# Altium schematic sheet atmusic.SchDoc: atmusic
size A4
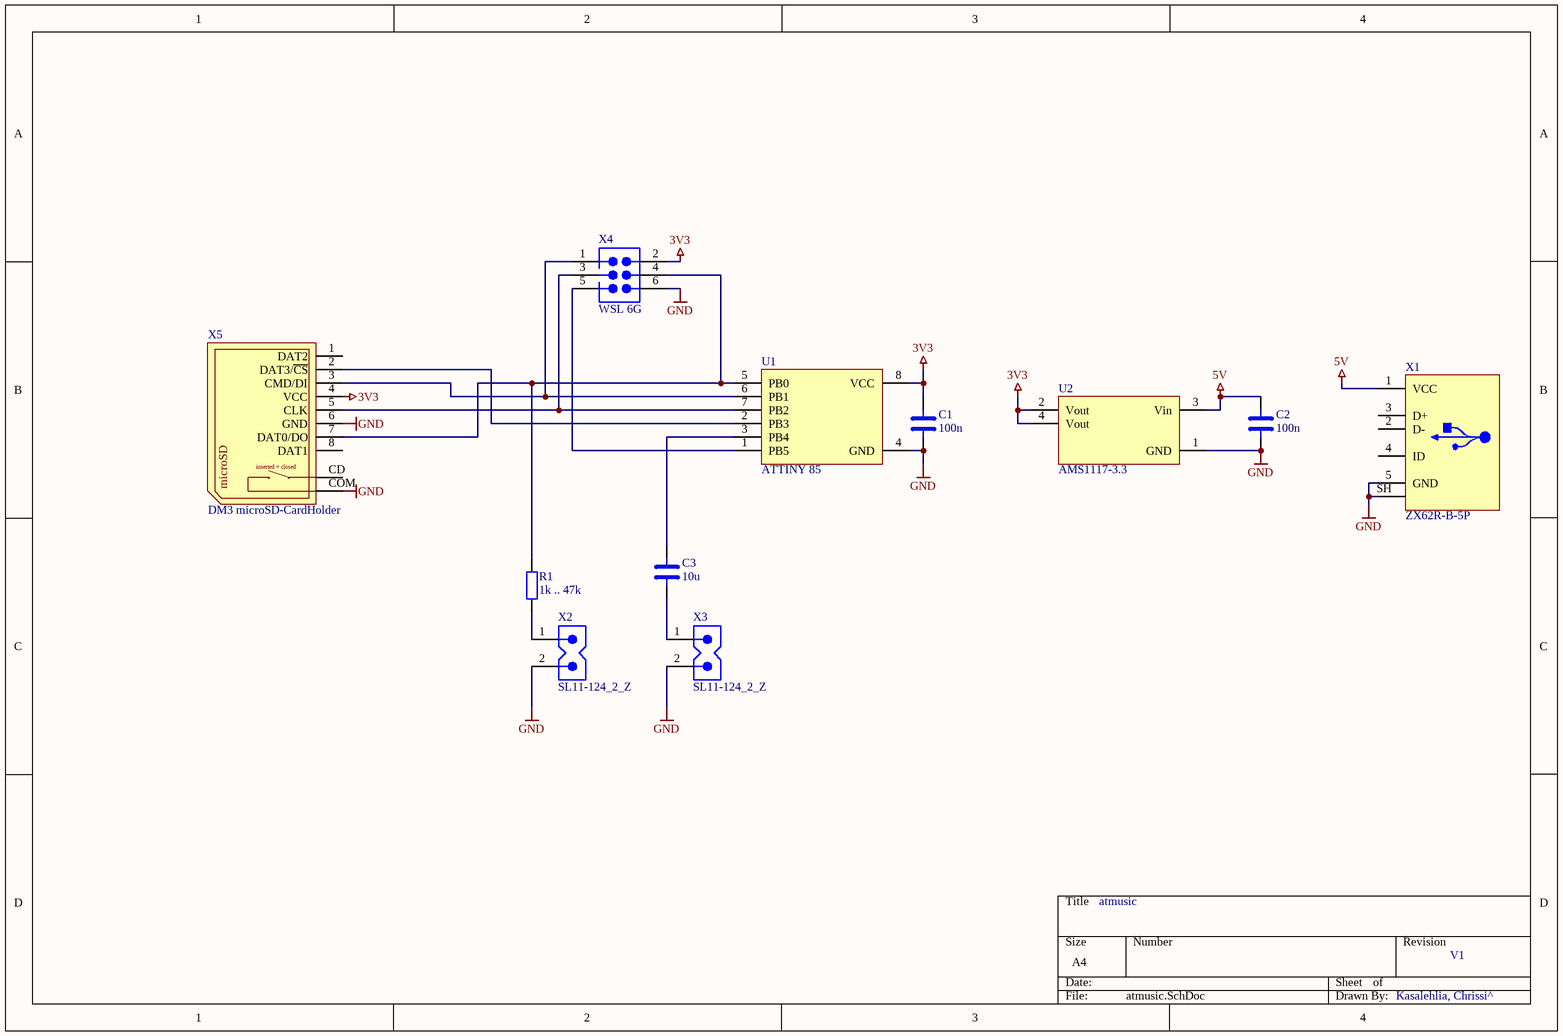
[diagram p0: atmusic.SchDoc]

## Parts
C1  100n  [CAPC1608X06N]
C2  100n  [CAPC1608X06N]
C3  10u  [CAPC3216X07N]
R1  1k .. 47k  [RESC1608X06N]
U1  ATTINY 85  [SOIC127P800X216-8N]
U2  AMS1117-3.3  [SOT230P700X180-4N]
X1  ZX62R-B-5P  [ZX62R-B-5P]
X2  SL11-124_2_Z  [Fischer_SL11-124_2_x]
X3  SL11-124_2_Z  [Fischer_SL11-124_2_x]
X4  WSL 6G  [WSL_6G]
X5  DM3 microSD-CardHolder  [DM3CS-SF]

## Nets
3V3: C1.2 U1.8(VCC) U2.2(Vout) U2.4(Vout) X4.2 X5.4(VCC)
5V: C2.2 U2.3(Vin) X1.1(VCC)
GND: C1.1 C2.1 U1.4(GND) U2.1(GND) X1.5(GND) X1.SH X2.2 X3.2 X4.6 X5.6(GND) X5.COM
NetC3_1: C3.1 X3.1
NetC3_2: C3.2 U1.3(PB4)
NetR1_1: R1.1 X2.1
NetR1_2: R1.2 U1.5(PB0) X4.4 X5.7(DAT0/DO)
NetU1_1: U1.1(PB5) X4.5
NetU1_2: U1.2(PB3) X5.2(DAT3/~{CS})
NetU1_6: U1.6(PB1) X4.1 X5.3(CMD/DI)
NetU1_7: U1.7(PB2) X4.3 X5.5(CLK)

Not connected (* = marked no-connect by the designer): X1 2(D-) 3(D+) 4(ID); X5 1(DAT2) 8(DAT1) CD

## Notes on the sheet
- atmusic
- V1
- Kasalehlia, Chrissi^
- (in symbol DM3CS-SF) microSD; inserted = closed

## Library data of the parts
C1 C2 = X7R-G0603 100N: 100nF ±10% 0603 X7R Chip Capacitor, 16V; Bauteilart: Kondensator; Kategorie: Bauteil; Unterart: SMD-Vielschicht X7R; Hersteller: Murata; Polar: u; Part Number: X7R-G0603 100N; Value: 100n; PackageDescription: 0603; ComponentLink1Description: Datenblatt; ComponentLink2Description: Datenblatt; ComponentLink2URL: D:\Elektronik\PCB_Bibliothek\Reichelt\Datenblaetter\Kondensatoren\VielschichtX7R.pdf; Distributor_1: Reichelt; Distributor_1_Part_Number: X7R-G0603 100N; Distributor_1_Preis: 0,05; Mounting: SMT
C3 = X7R-G1206 10/25: 10uF ±10% 1206 X7R Chip Capacitor, 25V; Bauteilart: Kondensator; Kategorie: Bauteil; Unterart: MURATA High Caps X7R; Hersteller: Murata; Polar: u; Part Number: X7R-G1206 10/25; Value: 10u; PackageDescription: 1206; ComponentLink1Description: Datenblatt; ComponentLink2Description: Datenblatt; ComponentLink2URL: D:\Elektronik\PCB_Bibliothek\Reichelt\Datenblaetter\Kondensatoren\MurataC02e.pdf; Mounting: SMT
R1 = SMD R 0603: 1% 100mW 0603 Chip Resistor E12; Bauteilart: Widerstand; Kategorie: Bauteil; Unterart: SMD; Polar: u; Part Number: SMD R 0603; Value: 1k .. 47k; PackageDescription: 0603; ComponentLink1Description: Datenblatt; ComponentLink2Description: Datenblatt; ComponentLink2URL: D:\Elektronik\PCB_Bibliothek\Reichelt\Datenblaetter\; Distributor_1: Reichelt; Distributor_1_Preis: 0,1; Mounting: SMT
U1 = ATTINY 85-20 SU: 8-Bit Microcontroller with 8kBytes Flash; Ersteller: cf; Bauteilart: IC; Kategorie: Bauteil; Hersteller: Microchip; Polar: p; Part Number: ATTINY 85-20 SU; Value: ATTINY 85; Unterart: Controller; PackageDescription: SOIC8; ComponentLink1Description: Datenblatt; ComponentLink2Description: Datenblatt; ComponentLink2URL: D:\Elektronik\PCB_Bibliothek\Reichelt\Datenblaetter\IC\ATTINY85.pdf; Mounting: SMT
U2 = AMS1117-3.3: Low cost fixed linear regulator; Ersteller: cf; Bauteilart: IC; Kategorie: Bauteil; Unterart: Linear Regler; Hersteller: AMS; Polar: p; Part Number: AMS1117-3.3; Value: AMS1117-3.3; Erstelldatum: 01.03.2015; PackageDescription: SOT-223; ComponentLink1Description: Datenblatt; ComponentLink1URL: D:\Elektronik\PCB_Bibliothek\Other\Datenblaetter\AMS1117.pdf; Hersteller_Code_1: AMS1117-3.3; Distributor_1: ebay; Distributor_2_Preis: 0,25; Mounting: SMT
X1 = ZX62R-B-5P: Micro-USB, SMT, Reverse; Ersteller: avd; Bauteilart: Steckverbinder; Kategorie: Bauteil; Unterart: USB; Hersteller: Hirose; Polar: p; Part Number: ZX62R-B-5P; Value: ZX62R-B-5P; Erstelldatum: 16.02.2014; PackageDescription: SMT, 5-Pol; ComponentLink1Description: Datenblatt; ComponentLink1URL: D:\Elektronik\PCB_Bibliothek\Other\Datenblaetter\Hirose_ZX_Series.pdf; Hersteller_Code_1: ZX62R-B-5P; Distributor_1: Farnell; Distributor_1_Part_Number: 2300439; Mounting: SMT; Distributor_1_Preis: 1,8
X2 X3 = SL11-124_2_Z: Stiftleiste THT 2 reihig Rastermaß 2,54mm; Ersteller: gserhorn; Freigabe: unchecked; Bauteilart: Steckverbinder; Kategorie: Bauteil; Hersteller: Fischerelektronik; Part Number: SL11-124_2_Z; Value: SL11-124_2_Z; ComponentLink1Description: Datasheet; ComponentLink1URL: D:\HSC_Bibliothek\Datenblaetter\pcb\Steckverbinder\Fischerelektronik\; Erstelldatum: 05.11.2010; Unterart: Stiftleiste; PackageDescription: Stiftleiste 2 pol. 2,54mm Rastermaß; Hersteller_Code_1: SL11-124_2_Z; Mounting: THT
X4 = WSL 6G: Wannenstecker, 6Pol, 2,54mm RM; Ersteller: cf; Bauteilart: Steckverbinder; Kategorie: Bauteil; Hersteller: diverse; Part Number: WSL 6G; Value: WSL 6G; Unterart: Wannenstecker; PackageDescription: Wanne, 6Pol; Mounting: THT
X5 = DM3CS-SF: DM3-Series microSD Memory-Card Hinge Connector (Push-Pull, no election); Ersteller: gmbaetje; Freigabe: unchecked; Bauteilart: Steckverbinder; Kategorie: Bauteil; Unterart: Kartenhalter; Hersteller: Hirose; Hersteller_Code_1: CL609-0032-3; Polar: p; Part Number: DM3CS-SF; Value: DM3 microSD-CardHolder; ComponentLink1Description: Datasheet; ComponentLink1URL: D:\HSC_Bibliothek\Datenblaetter\pcb\Steckverbinder\\Hirose\DM3-Series.pdf; Erstelldatum: 01.10.2010; PackageDescription: DM3 Series Standard-Package; Hersteller_Code_1_packaging: Reel 1300; Mounting: SMT